# Altium project lightshowctl.PrjPcb
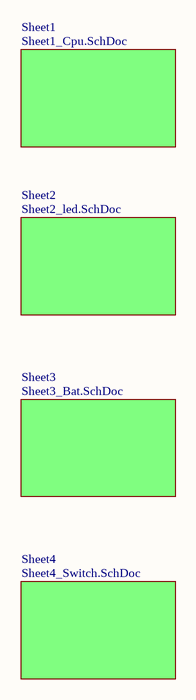
[diagram p0: Sheet0_Top.SchDoc]
5 sheets, 46 parts. Net scope: global (net labels, ports and power ports of the same name join across sheets).
Board file: lightshowctl.PcbDoc
Sheets:
  Sheet0_Top.SchDoc
    Sheet1 = Sheet1_Cpu.SchDoc
    Sheet2 = Sheet2_led.SchDoc
    Sheet3 = Sheet3_Bat.SchDoc
    Sheet4 = Sheet4_Switch.SchDoc

## Sheet Sheet0_Top.SchDoc
size A4

### Sub-sheets
Sheet1 = Sheet1_Cpu.SchDoc: no entries
Sheet2 = Sheet2_led.SchDoc: no entries
Sheet3 = Sheet3_Bat.SchDoc: no entries
Sheet4 = Sheet4_Switch.SchDoc: no entries

## Sheet Sheet1_Cpu.SchDoc
size A4
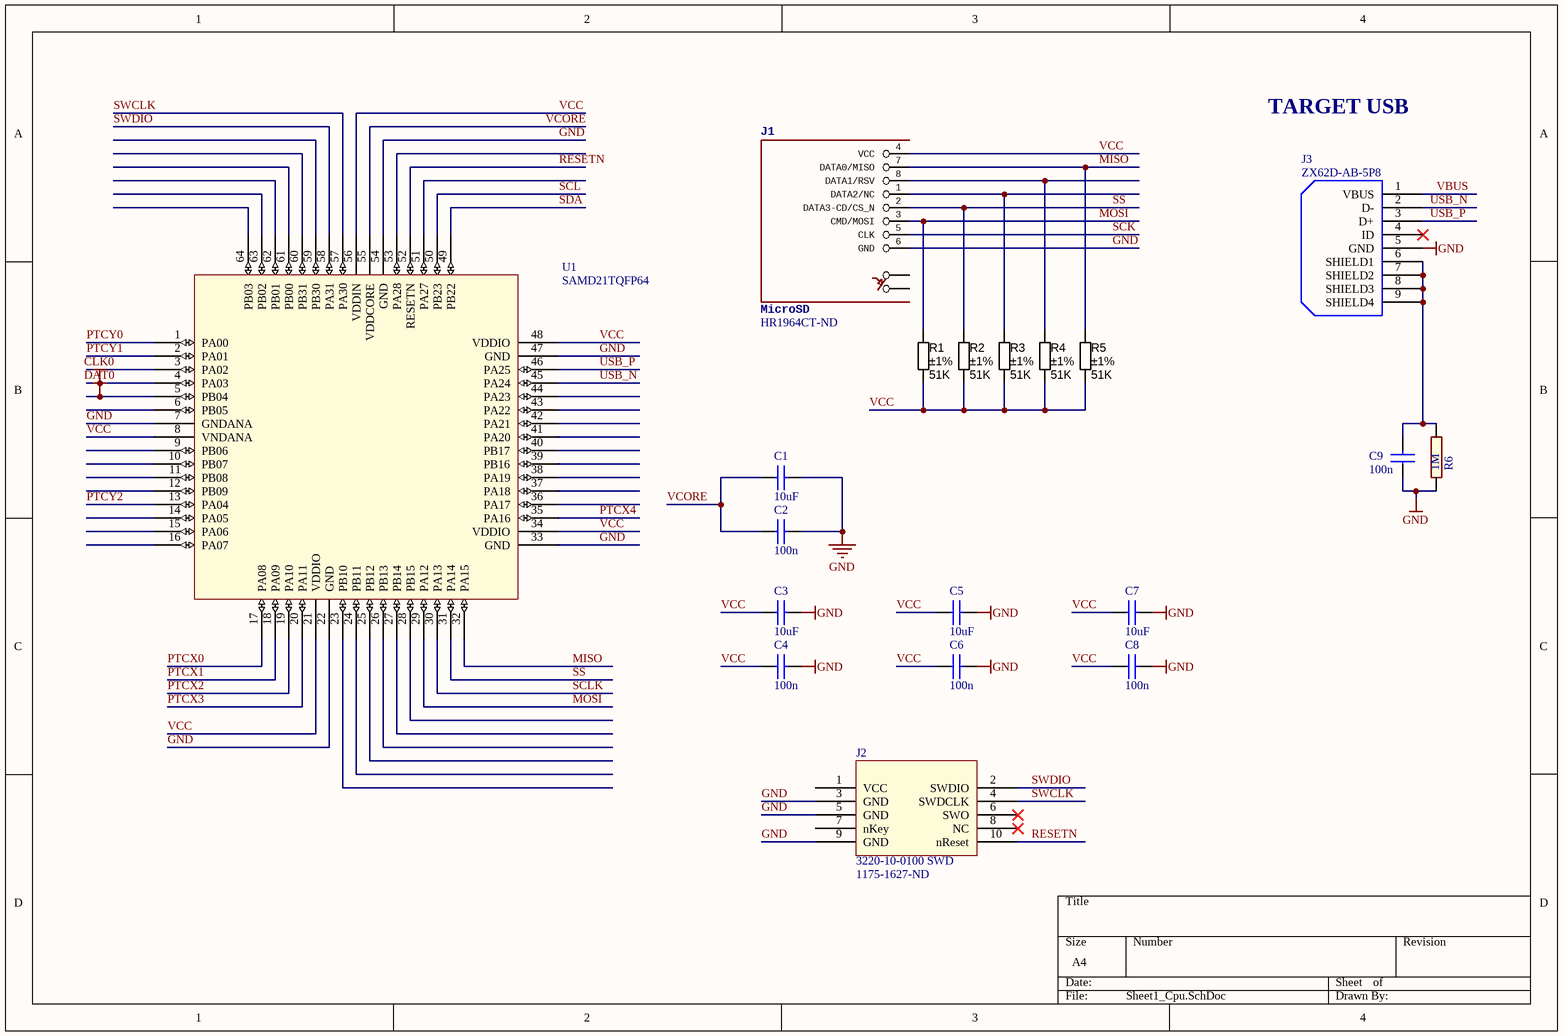
[diagram p1: Sheet1_Cpu.SchDoc]

### Parts
C1  value 10uF  [AP1-00041]
C2  value 100n  [AP1-00001]  (hidden comment: CAP-NONPOL)
C3  value 10uF  [AP1-00041]
C4  value 100n  [AP1-00001]  (hidden comment: CAP-NONPOL)
C5  value 10uF  [AP1-00041]
C6  value 100n  [AP1-00001]  (hidden comment: CAP-NONPOL)
C7  value 10uF  [AP1-00041]
C8  value 100n  [AP1-00001]  (hidden comment: CAP-NONPOL)
C9  value 100n  [AP1-00001]  (hidden comment: CAP-NONPOL)
J1  MicroSD  Supplier Part Number 1: HR1964CT-ND  [DM3AT-SF-PEJM5]
J2  3220-10-0100 SWD  Supplier Part Number 1: 1175-1627-ND  [3220-10-0100]
J3  ZX62D-AB-5P8  [AP8-00852]
R1  value 51K  Tolerance: ±1%  [RESC2012X70N]  (hidden comment: Thick Film)
R2  value 51K  Tolerance: ±1%  [RESC2012X70N]  (hidden comment: Thick Film)
R3  value 51K  Tolerance: ±1%  [RESC2012X70N]  (hidden comment: Thick Film)
R4  value 51K  Tolerance: ±1%  [RESC2012X70N]  (hidden comment: Thick Film)
R5  value 51K  Tolerance: ±1%  [RESC2012X70N]  (hidden comment: Thick Film)
R6  value 1M  [AP2-00011]  (hidden comment: R2)
U1  SAMD21TQFP64  [TSQFP50P1300X1300X120-64N]

### Nets
CLK0: U1.4(PA03)
DAT0: U1.5(PB04)
GND: C1.2 C2.2 C3.2 C4.2 C5.2 C6.2 C7.2 C8.2 C9.1 J1.6(GND) J2.3(GND) J2.5(GND) J2.9(GND) J3.5(GND) R6.1 U1.7(GNDANA) U1.22(GND) U1.33(GND) U1.47(GND) U1.54(GND)
MISO: J1.7(DATA0/MISO) R5.1 U1.32(PA15)
MOSI: J1.3(CMD/MOSI) R1.2 U1.29(PA12)
PTCX0: U1.17(PA08)
PTCX1: U1.18(PA09)
PTCX2: U1.19(PA10)
PTCX3: U1.20(PA11)
PTCX4: U1.35(PA16)
PTCY0: U1.1(PA00)
PTCY1: U1.2(PA01)
PTCY2: U1.13(PA04)
RESETN: J2.10(nReset) U1.52(RESETN)
SCK: J1.5(CLK)
SCL: U1.50(PB23)
SCLK: U1.30(PA13)
SDA: U1.49(PB22)
SS: J1.2(DATA3-CD/CS_N) R2.2 U1.31(PA14)
SWCLK: J2.4(SWDCLK) U1.57(PA30)
SWDIO: J2.2(SWDIO) U1.58(PA31)
USB_N: J3.2(D-) U1.45(PA24)
USB_P: J3.3(D+) U1.46(PA25)
VBUS: J3.1(VBUS)
VCC: C3.1 C4.1 C5.1 C6.1 C7.1 C8.1 J1.4(VCC) R1.1 R2.1 R3.2 R4.2 R5.2 U1.8(VNDANA) U1.21(VDDIO) U1.34(VDDIO) U1.48(VDDIO) U1.56(VDDIN)
VCORE: C1.1 C2.1 U1.55(VDDCORE)
NetC9_2: C9.2 J3.6(SHIELD1) J3.7(SHIELD2) J3.8(SHIELD3) J3.9(SHIELD4) R6.2
NetJ1_1: J1.1(DATA2/NC) R3.1
NetJ1_8: J1.8(DATA1/RSV) R4.1

Not connected (* = marked no-connect by the designer): J1 A B; J2 1(VCC) 6(SWO)* 7(nKey) 8(NC)*; J3 4(ID)*; U1 3(PA02) 6(PB05) 9(PB06) 10(PB07) 11(PB08) 12(PB09) 14(PA05) 15(PA06) 16(PA07) 23(PB10) 24(PB11) 25(PB12) 26(PB13) 27(PB14) 28(PB15) 36(PA17) 37(PA18) 38(PA19) 39(PB16) 40(PB17) 41(PA20) 42(PA21) 43(PA22) 44(PA23) 51(PA27) 53(PA28) 59(PB30) 60(PB31) 61(PB00) 62(PB01) 63(PB02) 64(PB03)

### Notes on the sheet
- TARGET USB

### Library data of the parts
C1 C3 C5 C7 = A01-0360: Ceramic capacitor, SMD 0805, X5R, 10V, 10 %, (de19441); PartGroup: Capacitors,Ceramic,SMD 0805; Manufacturer: Murata; MPN: GRM21BR61A106KE19L; Tolerance: 10%; TemperatureRange: -55 - +85 deg C; AN: A01-0360; Height: 1,25
C2 C4 C6 C8 C9 = A01-0246: Ceramic capacitor, SMD 0402, X7R, 16V, +/-10%; PartGroup: Capacitors,Ceramic,SMD 0402; Manufacturer: Kemet; MPN: C0402C104K4RACTU; TemperatureRange: -55 - +125 deg C; AN: A01-0246; Tolerance: 16V, +/-10%; Height: 0,5
J1 = DM3AT-SF-PEJM5: Hirose Electric Micro SD - DM3AT-SF-PEJM5; Supplier 1: Digi-Key
J2 = 3220-10-0100-00: HiRose 3220-10-0100 BOX HEADER, 0.050 10 POS; Supplier 1: Digi-Key
J3 = A08-2112: Hirose ZX62D-AB-5P8 Micro USB AB Connector, Standard SMT + DIP; PartGroup: Mechanical devices,Connectors,USB; AN: A08-2112; Value: ZX62D-AB-5P8; Height: 2,79999995231628
R1-R5 = RES_51K_0805_1%: Resistor SMD chip 51k Ohm 0.125W 1% 0805; Manufacturer 1: Yageo; Manufacturer Part Number 1: RC0805FR-0751KL; Ratings: 1/8W; SCDType: spec; Package / Case: 0805 (2012 Metric); Supplier 1: Digi-Key; Supplier Part Number 1: 311-51.0KCRCT-ND
R6 = A02-0284: Thick film resistor, SMD 0402, 1/16W, 1%; PartGroup: Resistors,SMD,0402 1%; Manufacturer: KOA; MPN: RK73H1ETTP1004F; TemperatureRange: -55 - +125 deg C; AN: A02-0284; Tolerance: 1 %; Height: 0,349999994039536
U1 = ATSAMD21J18A-AUT

## Sheet Sheet2_led.SchDoc
size A4
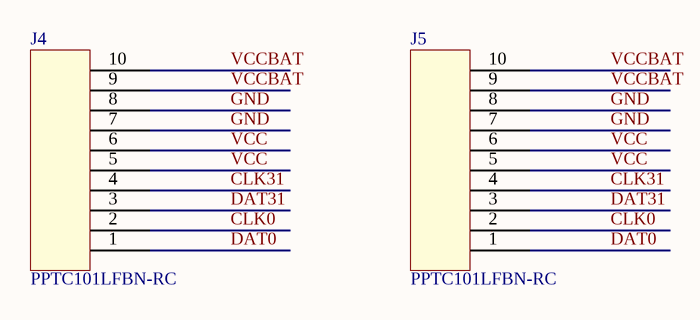
[diagram p2: Sheet2_led.SchDoc]

### Parts
J4  PPTC101LFBN-RC  [PPTC101LFBN-RC]
J5  PPTC101LFBN-RC  [PPTC101LFBN-RC]

### Nets
CLK0: J4.2 J5.2
DAT0: J4.1 J5.1
GND: J4.7 J4.8 J5.7 J5.8
CLK31: J4.4 J5.4
DAT31: J4.3 J5.3
VCC: J4.5 J4.6 J5.5 J5.6
VCCBAT: J4.9 J4.10 J5.9 J5.10

### Library data of the parts
J4 J5 = PPTC101LFBN-RC: Sullins PPTC101LFBN-RC 10 Position Header Connector 0.100" (2.54mm) Through Hole Tin

## Sheet Sheet3_Bat.SchDoc
size A4
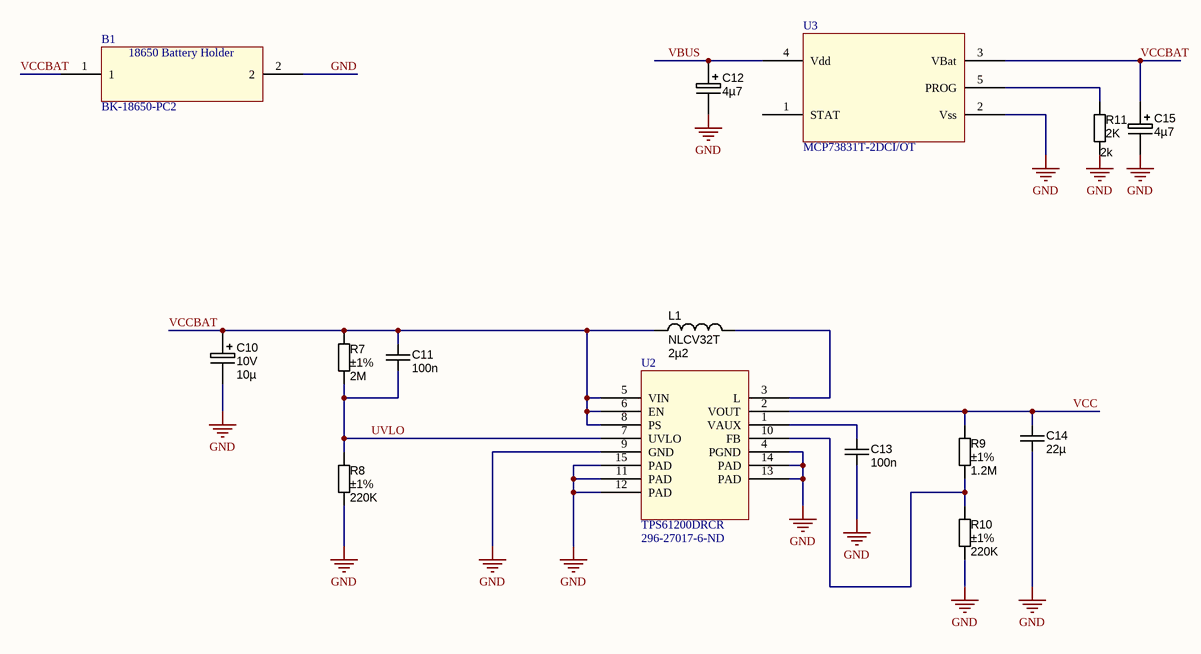
[diagram p3: Sheet3_Bat.SchDoc]

### Parts
B1  BK-18650-PC2  [BK-18650-PC2]
C10  Ratings: 10V  [CAPMP2012X150USR]  (hidden comment: 10µ)
C11  value 100n  [CAPC2012X135N]  (hidden comment: approved sub OK)
C12  4µ7  [CAPMP3216X180N]
C13  value 100n  [CAPC2012X135N]  (hidden comment: approved sub OK)
C14  value 22µ  [CAPC3225X220N]  (hidden comment: approved sub OK)
C15  4µ7  [CAPMP3216X180N]
L1  NLCV32T  value 2µ2  [INDM3225X240N]
R7  value 2M  Tolerance: ±1%  [RESC2012X70N]  (hidden comment: Thick Film)
R8  value 220K  Tolerance: ±1%  [RESC2012X70N]  (hidden comment: Thick Film)
R9  value 1.2M  Tolerance: ±1%  [RESC2012X70N]  (hidden comment: Thick Film)
R10  value 220K  Tolerance: ±1%  [RESC2012X70N]  (hidden comment: Thick Film)
R11  2k  [RESC1005X40N]
U2  TPS61200DRCR  Supplier Part Number 1: 296-27017-6-ND  [QFN-10_PAD]
U3  MCP73831T-2DCI/OT  [SOT95P270X145-5N]

### Nets
GND: B1.2 C10.2 C12.2 C13.2 C14.2 C15.2 R8.2 R10.2 R11.1 U2.4(PGND) U2.9(GND) U2.11(PAD) U2.12(PAD) U2.13(PAD) U2.14(PAD) U2.15(PAD) U3.2(Vss)
UVLO: C11.2 R7.2 R8.1 U2.7(UVLO)
VBUS: C12.1 U3.4(Vdd)
VCC: C14.1 R9.1 U2.2(VOUT)
VCCBAT: B1.1 C10.1 C11.1 C15.1 L1.1 R7.1 U2.5(VIN) U2.6(EN) U2.8(PS) U3.3(VBat)
NetC13_1: C13.1 U2.1(VAUX)
NetL1_2: L1.2 U2.3(L)
NetR9_2: R9.2 R10.1 U2.10(FB)
NetR11_2: R11.2 U3.5(PROG)

Not connected (* = marked no-connect by the designer): U3 1(STAT)

### Notes on the sheet
- (in symbol BK-18650-PC2) 18650 Battery Holder

### Library data of the parts
B1 = BK-18650-PC2: BK-18650-PC2 HOLDER BATT 1/LI-ION PROTECTED
C10 = CAPT_10u_0805_10V: Capacitor SMD Tantalum 10uF 20% 10V 0805; Manufacturer 1: AVX Corporation; Manufacturer Part Number 1: TAJP106M010RNJ; SCDType: spec; Package / Case: 0805 (2012 metric); Tolerance: ±20%; Material: Tantalum; Supplier 1: Digi-Key; Supplier Part Number 1: 478-3281-1-ND; Value: 10µ
C11 C13 = CAPC_100n_0805_X7R_100V_10%: Capacitor SMD Cer 100nF 10% 100V X7R 0805; Manufacturer 1: TDK Corporation; Manufacturer Part Number 1: C2012X7R2A104K; Ratings: 100V; X7R; Material: ceramic; SCDType: undef; Package / Case: 0805; Tolerance: ±10%; Supplier 1: Digi-Key; Supplier Part Number 1: 445-1418-1-ND
C12 C15 = CAPT_4u7_3216_16V: Capacitor SMD Tantalum 4.7uF 10% 16V 3216-18; Manufacturer 1: Vishay/Sprague; Manufacturer Part Number 1: 293D475X9016A2TE3; SCDType: undef; Package / Case: EIA 535BAAC size A; Ratings: 16V; Tolerance: ±10%; Material: Tantalum; Supplier 1: Digi-Key; Supplier Part Number 1: 718-1148-1-ND; Value: 4µ7
C14 = CAPC_22u_1210_16V: Capacitor SMD Cer 22uF 20% 16V X7R 1210; Manufacturer: TDK Corporation; Manufacturer Part Number: C3225X7R1C226K; Ratings: 16V; X7R; SCDType: spec; Tolerance: ±20%; Package / Case: 1210 (3225 metric); Supplier 1: Digi-Key; Supplier Part Number 1: 445-3945-2-ND
L1 = INDC_2u2_1210_1200mA: Inductor 2.2uH 1.2A 1210 SMD chip; Manufacturer 1: TDK Corporation; Manufacturer Part Number 1: NLCV32T-2R2M-PFR; Ratings: 1.2 Adc; Tolerance: ±20%; Type: Ferrite Core; DC Resistance (DCR): 115 mOhm; Q @ Freq: 15 @ 7.96MHz; Frequency - Self Resonant: 68MHz; Frequency - Test: 7.96MHz; SCDType: source; Package / Case: 1210 (3225 Metric); Supplier 1: Digi-Key; Supplier Part Number 1: 445-3650-1-ND; ComponentLink1URL: http://www.tdk.co.jp/tefe02/e511_nlcv_nlc.pdf; ComponentLink1Description: http://www.tdk.co.jp/tefe02/e511_nlcv_nlc.pdf; Operating Temperature: -40°C ~ 125°C
R7 = RES_2M_0805_1%: Resistor SMD chip 2M Ohm 0.125W 1% 0805; Ratings: 1/8W; SCDType: spec; Package / Case: 0805 (2012 metric); Supplier 1: Digi-Key; Supplier Part Number 1: 311-2.00MCRCT-ND
R8 R10 = RES_220K_0805_1%: Resistor SMD chip 220k Ohm 0.125W 1% 0805; Ratings: 1/8W; SCDType: spec; Package / Case: 0805 (2012 metric); Supplier 1: Digi-Key; Supplier Part Number 1: 311-220KCRCT-ND
R9 = RES_1p2m_0805_1%: Resistor SMD chip 1.2M Ohm 0.125W 1% 0805; Ratings: 1/8W; SCDType: spec; Package / Case: 0805 (2012 metric); Supplier 1: Digi-Key; Supplier Part Number 1: 311-1.20MCRDKR-ND
R11 = RES_2K_0402_1%: Resistor SMD chip 2k Ohm 0.063W 1% 0402; Ratings: 1/16 W; Tolerance: ±5%; SCDType: spec; Package / Case: 0402 (1005 metric); Material: Thick Film; ComponentLink1URL: http://www.vishay.com/doc?20035; ComponentLink1Description: http://www.vishay.com/doc?20035; ComponentLink2URL: http://www.yageo.com/documents/recent/PYu-RC0402_51_RoHS_L_6.pdf; ComponentLink2Description: http://www.yageo.com/documents/recent/PYu-RC0402_51_RoHS_L_6.pdf; Supplier 1: Digi-Key; Supplier 2: Allied; Value: 2K; Supplier Part Number 1: 541-2.00KLTR-ND; Supplier Part Number 2: 70265465
U2 = TPS61200DRCR: TPS61200DRCR Boost Switching Regulator IC Positive Adjustable 1.8V 1 Output 1.2A (Switch) 10-VFDFN Exposed Pad; Supplier 1: Digi-Key
U3 = MCP73831T-2DCI/OT: IC CONTROLLR LI-ION 4.2V SOT23-5

## Sheet Sheet4_Switch.SchDoc
size A4
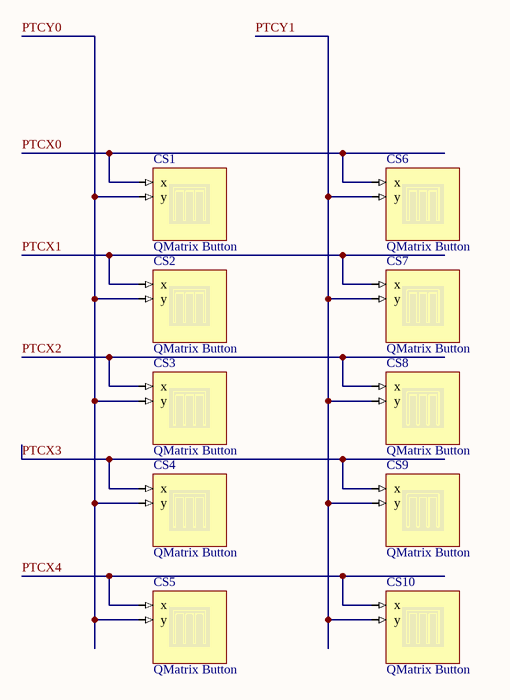
[diagram p4: Sheet4_Switch.SchDoc]

### Parts
CS1  QMatrix Button  [qtouchsw]  (no BOM)
CS2  QMatrix Button  [qtouchsw]  (no BOM)
CS3  QMatrix Button  [qtouchsw]  (no BOM)
CS4  QMatrix Button  [qtouchsw]  (no BOM)
CS5  QMatrix Button  [qtouchsw]  (no BOM)
CS6  QMatrix Button  [qtouchsw]  (no BOM)
CS7  QMatrix Button  [qtouchsw]  (no BOM)
CS8  QMatrix Button  [qtouchsw]  (no BOM)
CS9  QMatrix Button  [qtouchsw]  (no BOM)
CS10  QMatrix Button  [qtouchsw]  (no BOM)

### Nets
PTCX0: CS1.x CS6.x
PTCX1: CS2.x CS7.x
PTCX2: CS3.x CS8.x
PTCX3: CS4.x CS9.x
PTCX4: CS5.x CS10.x
PTCY0: CS1.y CS2.y CS3.y CS4.y CS5.y
PTCY1: CS6.y CS7.y CS8.y CS9.y CS10.y

### Library data of the parts
CS1-CS10 = QMatrixButton: ConfiguratorName: ATMEL_TOUCH; ConfigurationParameters: {}__sensorid[2]{}width[7]{}height[7]{}t[1]{}ywidth[0.3]{}

## Nets that join several sheets
CLK0: Sheet1_Cpu (U1.4), Sheet2_led (J4.2 J5.2)
DAT0: Sheet1_Cpu (U1.5), Sheet2_led (J4.1 J5.1)
GND: Sheet1_Cpu (20 pins), Sheet2_led (J4.7 J4.8 J5.7 J5.8), Sheet3_Bat (17 pins)
PTCX0: Sheet1_Cpu (U1.17), Sheet4_Switch (CS1.x CS6.x)
PTCX1: Sheet1_Cpu (U1.18), Sheet4_Switch (CS2.x CS7.x)
PTCX2: Sheet1_Cpu (U1.19), Sheet4_Switch (CS3.x CS8.x)
PTCX3: Sheet1_Cpu (U1.20), Sheet4_Switch (CS4.x CS9.x)
PTCX4: Sheet1_Cpu (U1.35), Sheet4_Switch (CS5.x CS10.x)
PTCY0: Sheet1_Cpu (U1.1), Sheet4_Switch (5 pins)
PTCY1: Sheet1_Cpu (U1.2), Sheet4_Switch (5 pins)
VBUS: Sheet1_Cpu (J3.1), Sheet3_Bat (C12.1 U3.4)
VCC: Sheet1_Cpu (17 pins), Sheet2_led (J4.5 J4.6 J5.5 J5.6), Sheet3_Bat (C14.1 R9.1 U2.2)
VCCBAT: Sheet2_led (J4.9 J4.10 J5.9 J5.10), Sheet3_Bat (10 pins)